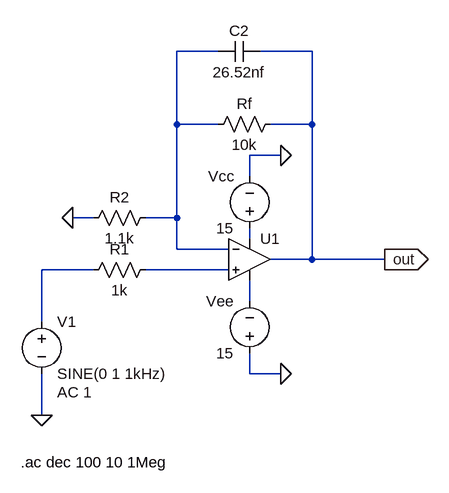
[diagram p0: schematic Day3_Acitve_low_pass_filter_opamp.asc]
Day3_Acitve_low_pass_filter_opamp.asc, the LTspice schematic file:
Version 4.1
SHEET 1 880 680
WIRE -64 -144 -128 -144
WIRE 80 -144 0 -144
WIRE -128 -32 -128 -144
WIRE -64 -32 -128 -32
WIRE 80 -32 80 -144
WIRE 80 -32 16 -32
WIRE 32 16 -16 16
WIRE -16 48 -16 16
WIRE -256 112 -288 112
WIRE -128 112 -128 -32
WIRE -128 112 -176 112
WIRE -16 144 -16 128
WIRE -128 160 -128 112
WIRE -48 160 -128 160
WIRE 80 176 80 -32
WIRE 80 176 16 176
WIRE 192 176 80 176
WIRE -256 192 -336 192
WIRE -48 192 -176 192
WIRE -16 240 -16 208
WIRE -336 272 -336 192
WIRE -16 352 -16 320
WIRE 32 352 -16 352
WIRE -336 416 -336 352
FLAG 32 16 0
FLAG 32 352 0
FLAG 192 176 out
IOPIN 192 176 Out
FLAG -288 112 0
FLAG -336 416 0
SYMBOL OpAmps\\UniversalOpAmp2 -16 176 R0
SYMATTR InstName U1
SYMBOL res -160 176 R90
WINDOW 0 0 56 VBottom 2
WINDOW 3 32 56 VTop 2
SYMATTR InstName R1
SYMATTR Value 1k
SYMBOL voltage -336 256 R0
WINDOW 123 24 124 Left 2
WINDOW 39 0 0 Left 0
SYMATTR Value2 AC 1
SYMATTR InstName V1
SYMATTR Value SINE(0 1 1kHz)
SYMBOL voltage -16 144 R180
WINDOW 0 24 96 Left 2
WINDOW 3 24 16 Left 2
WINDOW 123 0 0 Left 0
WINDOW 39 0 0 Left 0
SYMATTR InstName Vcc
SYMATTR Value 15
SYMBOL voltage -16 336 R180
WINDOW 0 24 96 Left 2
WINDOW 3 24 16 Left 2
WINDOW 123 0 0 Left 0
WINDOW 39 0 0 Left 0
SYMATTR InstName Vee
SYMATTR Value 15
SYMBOL res -160 96 R90
WINDOW 0 0 56 VBottom 2
WINDOW 3 32 56 VTop 2
SYMATTR InstName R2
SYMATTR Value 1.1k
SYMBOL res 32 -48 R90
WINDOW 0 0 56 VBottom 2
WINDOW 3 32 56 VTop 2
SYMATTR InstName Rf
SYMATTR Value 10k
SYMBOL cap 0 -160 R90
WINDOW 0 0 32 VBottom 2
WINDOW 3 32 32 VTop 2
SYMATTR InstName C2
SYMATTR Value 26.52nf
TEXT -368 488 Left 2 !.ac dec 100 10 1Meg

The netlist it stands for:
* Day3_Acitve_low_pass_filter_opamp.asc
X§U1 N004 N001 N002 N005 out level2 Avol=1Meg GBW=10Meg Slew=10Meg Ilimit=25m Rail=0 Vos=0 En=0 Enk=0 In=0 Ink=0 Rin=500Meg  ; pins In+ In- V+ V- OUT
R1 N004 N003 1k
V1 N003 0 SINE(0 1 1kHz) AC 1
Vcc N002 0 15
Vee 0 N005 15
R2 N001 0 1.1k
Rf out N001 10k
C2 out N001 26.52nf
.ac dec 100 10 1Meg
.lib UniversalOpAmp2.lib
.backanno
.end